# Altium project SVEC.PrjPcb (part 3 of 11)

## Sheet SFPGA.SchDoc: System FPGA
size 420 x 297 mm; CheckedBy: T.Janicki; CompanyName: Creotech Instruments SA; DrawnBy: G.Kasprowicz; Organization: CERN; Address1: European Organization for Nuclear Research; Address2: CH-1211 Geneve 23 - Switzerland; DocumentNumber: 10; Revision: -; SheetNumber: 15; SheetTotal: 21; EDA_Number: EDA-xxxx; Projet: Simple VME FMC Carrier; CreateDate: 20/11/2012; CheckedDate: 30/04/2012; DivGrp: BE-CO; Designer: G.Kasprowicz; DocumentName: SFPGA.SchDoc; ModifiedDate: -; Rule: PcbType=ProtelPcb
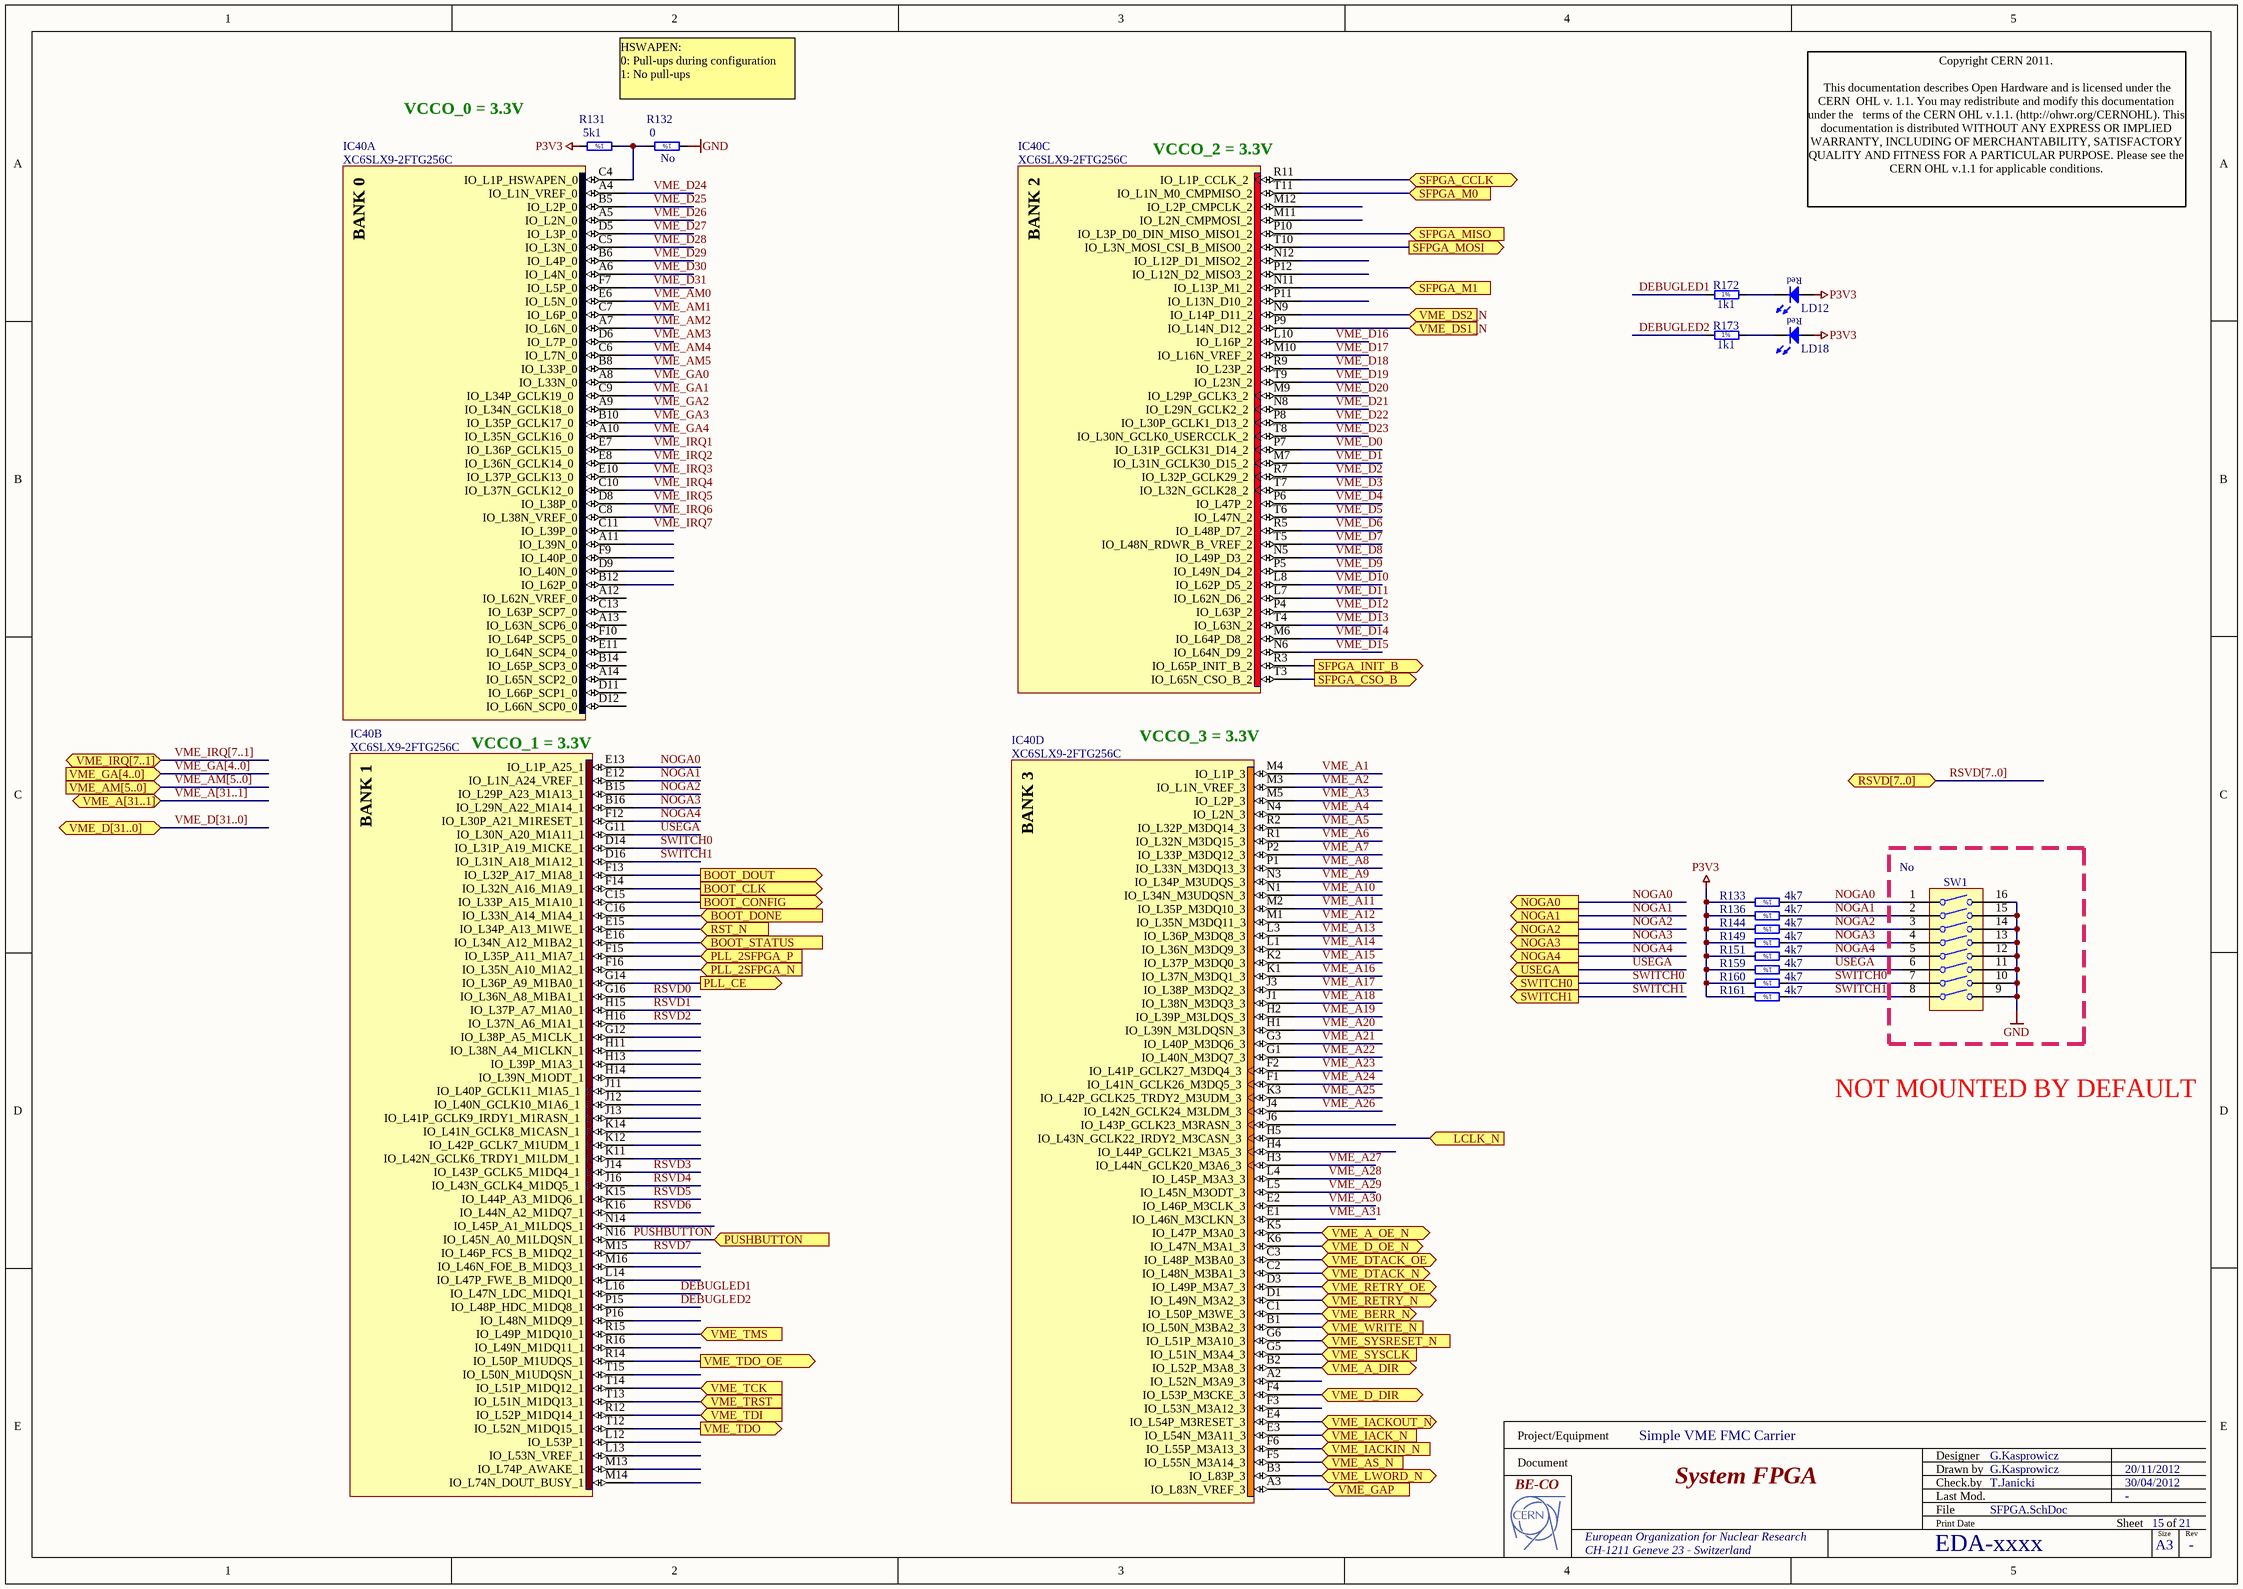
[diagram p2: SFPGA.SchDoc]

### Parts
IC40  XC6SLX9-2FTG256C  [BGA256C100P16X16_1700X1700X155]  (parts A,B,C,D of 7)
LD12  Red  [LEDC1608X80N_RED]  (value not drawn)
LD18  Red  [LEDC1608X80N_RED]  (value not drawn)
R131  5k1  [RESC1608X55N]
R132  0  Mounted: No  [RESC1608X55N]
R133  4k7  [RESC1608X55N]
R136  4k7  [RESC1608X55N]
R144  4k7  [RESC1608X55N]
R149  4k7  [RESC1608X55N]
R151  4k7  [RESC1608X55N]
R159  4k7  [RESC1608X55N]
R160  4k7  [RESC1608X55N]
R161  4k7  [RESC1608X55N]
R172  1k1  [RESC1608X55N]
R173  1k1  [RESC1608X55N]
SW1  Mounted: No  [SW_TYCO_1-1571983-0]  (hidden comment: Switch)

### Ports
BOOT_CLK (out), BOOT_CONFIG (out), BOOT_DONE (in), BOOT_DOUT (out), BOOT_STATUS (in), LCLK_N (in), NOGA0 (out), NOGA1 (out), NOGA2 (out), NOGA3 (out), NOGA4 (out), PLL_2SFPGA_N (in), PLL_2SFPGA_P (in), PLL_CE (out), PUSHBUTTON (in), RST_N (in), RSVD[7..0] (bidir), SFPGA_CCLK (bidir), SFPGA_CSO_B (out), SFPGA_INIT_B (out), SFPGA_M0 (in), SFPGA_M1 (in), SFPGA_MISO (in), SFPGA_MOSI (out), SWITCH0 (out), SWITCH1 (out), USEGA (out), VME_A[31..1] (bidir), VME_A_DIR (bidir), VME_A_OE_N (bidir), VME_AM[5..0] (in), VME_AS_N (in), VME_BERR_N (bidir), VME_D[31..0] (bidir), VME_D_DIR (bidir), VME_D_OE_N (bidir), VME_DS1_N (in), VME_DS2_N (in), VME_DTACK_N (bidir), VME_DTACK_OE (bidir), VME_GA[4..0] (in), VME_GAP (in), VME_IACK_N (in), VME_IACKIN_N (in), VME_IACKOUT_N (bidir), VME_IRQ[7..1] (bidir), VME_LWORD_N (bidir), VME_RETRY_N (bidir), VME_RETRY_OE (bidir), VME_SYSCLK (in), VME_SYSRESET_N (in), VME_TCK (in), VME_TDI (in), VME_TDO (out), VME_TDO_OE (out), VME_TMS (in), VME_TRST (in), VME_WRITE_N (in)

### Nets
GND: R132.1 SW1.9 SW1.10 SW1.11 SW1.12 SW1.13 SW1.14 SW1.15 SW1.16
P3V3: LD12.2(A) LD18.2(A) R131.2 R133.2 R136.2 R144.2 R149.2 R151.2 R159.2 R160.2 R161.2
BOOT_CLK: IC40.F14(IO_L32N_A16_M1A9_1) ; port BOOT_CLK
BOOT_CONFIG: IC40.C15(IO_L33P_A15_M1A10_1) ; port BOOT_CONFIG
BOOT_DONE: IC40.C16(IO_L33N_A14_M1A4_1) ; port BOOT_DONE
BOOT_DOUT: IC40.F13(IO_L32P_A17_M1A8_1) ; port BOOT_DOUT
BOOT_STATUS: IC40.E16(IO_L34N_A12_M1BA2_1) ; port BOOT_STATUS
DEBUGLED1: IC40.L16(IO_L47N_LDC_M1DQ1_1) R172.1
DEBUGLED2: IC40.P15(IO_L48P_HDC_M1DQ8_1) R173.1
LCLK_N: IC40.H5(IO_L43N_GCLK22_IRDY2_M3CASN_3) ; port LCLK_N
NOGA0: IC40.E13(IO_L1P_A25_1) R133.1 SW1.1 ; port NOGA0
NOGA1: IC40.E12(IO_L1N_A24_VREF_1) R136.1 SW1.2 ; port NOGA1
NOGA2: IC40.B15(IO_L29P_A23_M1A13_1) R144.1 SW1.3 ; port NOGA2
NOGA3: IC40.B16(IO_L29N_A22_M1A14_1) R149.1 SW1.4 ; port NOGA3
NOGA4: IC40.F12(IO_L30P_A21_M1RESET_1) R151.1 SW1.5 ; port NOGA4
PLL_2SFPGA_N: IC40.F16(IO_L35N_A10_M1A2_1) ; port PLL_2SFPGA_N
PLL_2SFPGA_P: IC40.F15(IO_L35P_A11_M1A7_1) ; port PLL_2SFPGA_P
PLL_CE: IC40.G14(IO_L36P_A9_M1BA0_1) ; port PLL_CE
PUSHBUTTON: IC40.N16(IO_L45N_A0_M1LDQSN_1) ; port PUSHBUTTON
RST_N: IC40.E15(IO_L34P_A13_M1WE_1) ; port RST_N
RSVD0: IC40.G16(IO_L36N_A8_M1BA1_1)
RSVD1: IC40.H15(IO_L37P_A7_M1A0_1)
RSVD2: IC40.H16(IO_L37N_A6_M1A1_1)
RSVD3: IC40.J14(IO_L43P_GCLK5_M1DQ4_1)
RSVD4: IC40.J16(IO_L43N_GCLK4_M1DQ5_1)
RSVD5: IC40.K15(IO_L44P_A3_M1DQ6_1)
RSVD6: IC40.K16(IO_L44N_A2_M1DQ7_1)
RSVD7: IC40.M15(IO_L46P_FCS_B_M1DQ2_1)
SFPGA_CCLK: IC40.R11(IO_L1P_CCLK_2) ; port SFPGA_CCLK
SFPGA_CSO_B: IC40.T3(IO_L65N_CSO_B_2) ; port SFPGA_CSO_B
SFPGA_INIT_B: IC40.R3(IO_L65P_INIT_B_2) ; port SFPGA_INIT_B
SFPGA_M0: IC40.T11(IO_L1N_M0_CMPMISO_2) ; port SFPGA_M0
SFPGA_M1: IC40.N11(IO_L13P_M1_2) ; port SFPGA_M1
SFPGA_MISO: IC40.P10(IO_L3P_D0_DIN_MISO_MISO1_2) ; port SFPGA_MISO
SFPGA_MOSI: IC40.T10(IO_L3N_MOSI_CSI_B_MISO0_2) ; port SFPGA_MOSI
SWITCH0: IC40.D14(IO_L31P_A19_M1CKE_1) R160.1 SW1.7 ; port SWITCH0
SWITCH1: IC40.D16(IO_L31N_A18_M1A12_1) R161.1 SW1.8 ; port SWITCH1
USEGA: IC40.G11(IO_L30N_A20_M1A11_1) R159.1 SW1.6 ; port USEGA
VME_A1: IC40.M4(IO_L1P_3)
VME_A2: IC40.M3(IO_L1N_VREF_3)
VME_A3: IC40.M5(IO_L2P_3)
VME_A4: IC40.N4(IO_L2N_3)
VME_A5: IC40.R2(IO_L32P_M3DQ14_3)
VME_A6: IC40.R1(IO_L32N_M3DQ15_3)
VME_A7: IC40.P2(IO_L33P_M3DQ12_3)
VME_A8: IC40.P1(IO_L33N_M3DQ13_3)
VME_A9: IC40.N3(IO_L34P_M3UDQS_3)
VME_A10: IC40.N1(IO_L34N_M3UDQSN_3)
VME_A11: IC40.M2(IO_L35P_M3DQ10_3)
VME_A12: IC40.M1(IO_L35N_M3DQ11_3)
VME_A13: IC40.L3(IO_L36P_M3DQ8_3)
VME_A14: IC40.L1(IO_L36N_M3DQ9_3)
VME_A15: IC40.K2(IO_L37P_M3DQ0_3)
VME_A16: IC40.K1(IO_L37N_M3DQ1_3)
VME_A17: IC40.J3(IO_L38P_M3DQ2_3)
VME_A18: IC40.J1(IO_L38N_M3DQ3_3)
VME_A19: IC40.H2(IO_L39P_M3LDQS_3)
VME_A20: IC40.H1(IO_L39N_M3LDQSN_3)
VME_A21: IC40.G3(IO_L40P_M3DQ6_3)
VME_A22: IC40.G1(IO_L40N_M3DQ7_3)
VME_A23: IC40.F2(IO_L41P_GCLK27_M3DQ4_3)
VME_A24: IC40.F1(IO_L41N_GCLK26_M3DQ5_3)
VME_A25: IC40.K3(IO_L42P_GCLK25_TRDY2_M3UDM_3)
VME_A26: IC40.J4(IO_L42N_GCLK24_M3LDM_3)
VME_A27: IC40.H3(IO_L44N_GCLK20_M3A6_3)
VME_A28: IC40.L4(IO_L45P_M3A3_3)
VME_A29: IC40.L5(IO_L45N_M3ODT_3)
VME_A30: IC40.E2(IO_L46P_M3CLK_3)
VME_A31: IC40.E1(IO_L46N_M3CLKN_3)
VME_A_DIR: IC40.B2(IO_L52P_M3A8_3) ; port VME_A_DIR
VME_A_OE_N: IC40.K5(IO_L47P_M3A0_3) ; port VME_A_OE_N
VME_AM0: IC40.E6(IO_L5N_0)
VME_AM1: IC40.C7(IO_L6P_0)
VME_AM2: IC40.A7(IO_L6N_0)
VME_AM3: IC40.D6(IO_L7P_0)
VME_AM4: IC40.C6(IO_L7N_0)
VME_AM5: IC40.B8(IO_L33P_0)
VME_AS_N: IC40.F5(IO_L55N_M3A14_3) ; port VME_AS_N
VME_BERR_N: IC40.C1(IO_L50P_M3WE_3) ; port VME_BERR_N
VME_D0: IC40.P7(IO_L31P_GCLK31_D14_2)
VME_D1: IC40.M7(IO_L31N_GCLK30_D15_2)
VME_D2: IC40.R7(IO_L32P_GCLK29_2)
VME_D3: IC40.T7(IO_L32N_GCLK28_2)
VME_D4: IC40.P6(IO_L47P_2)
VME_D5: IC40.T6(IO_L47N_2)
VME_D6: IC40.R5(IO_L48P_D7_2)
VME_D7: IC40.T5(IO_L48N_RDWR_B_VREF_2)
VME_D8: IC40.N5(IO_L49P_D3_2)
VME_D9: IC40.P5(IO_L49N_D4_2)
VME_D10: IC40.L8(IO_L62P_D5_2)
VME_D11: IC40.L7(IO_L62N_D6_2)
VME_D12: IC40.P4(IO_L63P_2)
VME_D13: IC40.T4(IO_L63N_2)
VME_D14: IC40.M6(IO_L64P_D8_2)
VME_D15: IC40.N6(IO_L64N_D9_2)
VME_D16: IC40.L10(IO_L16P_2)
VME_D17: IC40.M10(IO_L16N_VREF_2)
VME_D18: IC40.R9(IO_L23P_2)
VME_D19: IC40.T9(IO_L23N_2)
VME_D20: IC40.M9(IO_L29P_GCLK3_2)
VME_D21: IC40.N8(IO_L29N_GCLK2_2)
VME_D22: IC40.P8(IO_L30P_GCLK1_D13_2)
VME_D23: IC40.T8(IO_L30N_GCLK0_USERCCLK_2)
VME_D24: IC40.A4(IO_L1N_VREF_0)
VME_D25: IC40.B5(IO_L2P_0)
VME_D26: IC40.A5(IO_L2N_0)
VME_D27: IC40.D5(IO_L3P_0)
VME_D28: IC40.C5(IO_L3N_0)
VME_D29: IC40.B6(IO_L4P_0)
VME_D30: IC40.A6(IO_L4N_0)
VME_D31: IC40.F7(IO_L5P_0)
VME_D_DIR: IC40.F4(IO_L53P_M3CKE_3) ; port VME_D_DIR
VME_D_OE_N: IC40.K6(IO_L47N_M3A1_3) ; port VME_D_OE_N
VME_DS1_N: IC40.P9(IO_L14N_D12_2) ; port VME_DS1_N
VME_DS2_N: IC40.N9(IO_L14P_D11_2) ; port VME_DS2_N
VME_DTACK_N: IC40.C2(IO_L48N_M3BA1_3) ; port VME_DTACK_N
VME_DTACK_OE: IC40.C3(IO_L48P_M3BA0_3) ; port VME_DTACK_OE
VME_GA0: IC40.A8(IO_L33N_0)
VME_GA1: IC40.C9(IO_L34P_GCLK19_0)
VME_GA2: IC40.A9(IO_L34N_GCLK18_0)
VME_GA3: IC40.B10(IO_L35P_GCLK17_0)
VME_GA4: IC40.A10(IO_L35N_GCLK16_0)
VME_GAP: IC40.A3(IO_L83N_VREF_3) ; port VME_GAP
VME_IACK_N: IC40.E3(IO_L54N_M3A11_3) ; port VME_IACK_N
VME_IACKIN_N: IC40.F6(IO_L55P_M3A13_3) ; port VME_IACKIN_N
VME_IACKOUT_N: IC40.E4(IO_L54P_M3RESET_3) ; port VME_IACKOUT_N
VME_IRQ1: IC40.E7(IO_L36P_GCLK15_0)
VME_IRQ2: IC40.E8(IO_L36N_GCLK14_0)
VME_IRQ3: IC40.E10(IO_L37P_GCLK13_0)
VME_IRQ4: IC40.C10(IO_L37N_GCLK12_0)
VME_IRQ5: IC40.D8(IO_L38P_0)
VME_IRQ6: IC40.C8(IO_L38N_VREF_0)
VME_IRQ7: IC40.C11(IO_L39P_0)
VME_LWORD_N: IC40.B3(IO_L83P_3) ; port VME_LWORD_N
VME_RETRY_N: IC40.D1(IO_L49N_M3A2_3) ; port VME_RETRY_N
VME_RETRY_OE: IC40.D3(IO_L49P_M3A7_3) ; port VME_RETRY_OE
VME_SYSCLK: IC40.G5(IO_L51N_M3A4_3) ; port VME_SYSCLK
VME_SYSRESET_N: IC40.G6(IO_L51P_M3A10_3) ; port VME_SYSRESET_N
VME_TCK: IC40.T14(IO_L51P_M1DQ12_1) ; port VME_TCK
VME_TDI: IC40.R12(IO_L52P_M1DQ14_1) ; port VME_TDI
VME_TDO: IC40.T12(IO_L52N_M1DQ15_1) ; port VME_TDO
VME_TDO_OE: IC40.R14(IO_L50P_M1UDQS_1) ; port VME_TDO_OE
VME_TMS: IC40.R15(IO_L49P_M1DQ10_1) ; port VME_TMS
VME_TRST: IC40.T13(IO_L51N_M1DQ13_1) ; port VME_TRST
VME_WRITE_N: IC40.B1(IO_L50N_M3BA2_3) ; port VME_WRITE_N
NetIC40_C4: IC40.C4(IO_L1P_HSWAPEN_0) R131.1 R132.2
NetLD12_1: LD12.1(C) R172.2
NetLD18_1: LD18.1(C) R173.2

Not connected (* = marked no-connect by the designer): IC40 A2(IO_L52N_M3A9_3) A11(IO_L39N_0) A12(IO_L62N_VREF_0) A13(IO_L63N_SCP6_0) A14(IO_L65N_SCP2_0) B12(IO_L62P_0) B14(IO_L65P_SCP3_0) C13(IO_L63P_SCP7_0) D9(IO_L40N_0) D11(IO_L66P_SCP1_0) D12(IO_L66N_SCP0_0) E11(IO_L64N_SCP4_0) F3(IO_L53N_M3A12_3) F9(IO_L40P_0) F10(IO_L64P_SCP5_0) G12(IO_L38P_A5_M1CLK_1) H4(IO_L44P_GCLK21_M3A5_3) H11(IO_L38N_A4_M1CLKN_1) H13(IO_L39P_M1A3_1) H14(IO_L39N_M1ODT_1) J6(IO_L43P_GCLK23_M3RASN_3) J11(IO_L40P_GCLK11_M1A5_1) J12(IO_L40N_GCLK10_M1A6_1) J13(IO_L41P_GCLK9_IRDY1_M1RASN_1) K11(IO_L42N_GCLK6_TRDY1_M1LDM_1) K12(IO_L42P_GCLK7_M1UDM_1) K14(IO_L41N_GCLK8_M1CASN_1) L12(IO_L53P_1) L13(IO_L53N_VREF_1) L14(IO_L47P_FWE_B_M1DQ0_1) M11(IO_L2N_CMPMOSI_2) M12(IO_L2P_CMPCLK_2) M13(IO_L74P_AWAKE_1) M14(IO_L74N_DOUT_BUSY_1) M16(IO_L46N_FOE_B_M1DQ3_1) N12(IO_L12P_D1_MISO2_2) N14(IO_L45P_A1_M1LDQS_1) P11(IO_L13N_D10_2) P12(IO_L12N_D2_MISO3_2) P16(IO_L48N_M1DQ9_1) R16(IO_L49N_M1DQ11_1) T15(IO_L50N_M1UDQSN_1)

### Buses and harness runs
bus RSVD[7..0] = port RSVD[7..0]
bus VME_A[31..1] = port VME_A[31..1]
bus VME_AM[5..0] = port VME_AM[5..0]
bus VME_D[31..0] = port VME_D[31..0]
bus VME_GA[4..0] = port VME_GA[4..0]
bus VME_IRQ[7..1] = port VME_IRQ[7..1]

### Notes on the sheet
- VCCO_0 = 3.3V
- HSWAPEN:
  0: Pull-ups during configuration
  1: No pull-ups
- (near IC40) VCCO_2 = 3.3V
- Copyright CERN 2011.
  This documentation describes Open Hardware and is licensed under the CERN  OHL v. 1.1. You may redistribute and modify this documentation under the   terms of the CERN OHL v.1.1. (http://ohwr.org/CERNOHL). This  documentation is distributed WITHOUT ANY EXPRESS OR IMPLIED  WARRANTY, INCLUDING OF MERCHANTABILITY, SATISFACTORY  QUALITY AND FITNESS FOR A PARTICULAR PURPOSE. Please see the  CERN OHL v.1.1 for applicable conditions.
- (near IC40) VCCO_1 = 3.3V
- (near IC40) VCCO_3 = 3.3V
- NOT MOUNTED BY DEFAULT
- Project/Equipment
- Document
- Designer
- Drawn by
- Check.by
- File
- Last Mod.
- Print Date
- Sheet
- Size
- A3
- of
- Rev
- (in symbol R0603_0R_JUMPER) 1%
- (in symbol R0603_1K1_1%_0.1W_100PPM) 1%
- (in symbol R0603_4K7_1%_0.1W_100PPM) 1%
- (in symbol R0603_5K1_1%_0.1W_100PPM) 1%
- (in symbol XC6SLX9-2FTG256C, part A) BANK 0
- (in symbol XC6SLX9-2FTG256C, part B) BANK 1
- (in symbol XC6SLX9-2FTG256C, part C) BANK 2
- (in symbol XC6SLX9-2FTG256C, part D) BANK 3

### Library data of the parts
IC40 = XC6SLX9-2FTG256C: Spartan-6 LX 1.2V FPGA, 186 User I/Os, 256-Ball Fine-Pitch Thin BGA (1.0mm Pitch), Speed Grade 2, Commercial Grade, Pb-Free; Manufacturer: XILINX; Table: Logic; Part Number: XC6SLX9-2FTG256C; Component Kind: Standard; Component Type: Standard; Device: XC6SLX9-2FTG256C; PackageDescription: BGA 1mm, Pitch, Square 256 Pin, 16 Columns x 16 Rows, Body 17mm X 17mm X 1.55mm H; Part Description: Spartan-6 LX 1.2V FPGA, 186 User I/Os, 256-Ball Fine-Pitch Thin BGA (1.0mm Pitch), Speed Grade 2, Commercial Grade, Pb-Free; Manufacturer Part Number: XC6SLX9-2FTG256C; Pin Count: 256; Case: BGA256; Mounted: Yes; Socket: No; SMD: Yes; ComponentHeight: 1.55mm; HelpURL: \\cern.ch\dfs\Applications\Altium\Datasheets\XC6SLX9-2FTG256C.pdf; ComponentLink1URL: \\cern.ch\dfs\Applications\Altium\Datasheets\XC6SLX9-2FTG256C_Package-Pinout.pdf; ComponentLink1Description: Package/Pinouts; Author: CERN DEM JLC; CreateDate: 2011-11-01; LatestRevisionDate: 2011-11-01
LD12 LD18 = LED_ROHM_SML-311UTT86K: LED Red 1C 2A; Part Description: Low current chip LED SML-311 Serie; Manufacturer: ROHM; Table: LEDs & Displays; Part Number: LED_ROHM_SML-311UTT86K; Component Kind: Standard; Component Type: Standard; Color: Red; PackageDescription: Chip RED LED, 2-Leads, Body 1.6x0.8mm, IPC Medium Density; Manufacturer Part Number: SML-311UTT86K; Pin Count: 2; Mounted: Yes; Socket: No; SMD: Yes; ComponentHeight: 0.8mm; HelpURL: \\cern.ch\dfs\Applications\Altium\Datasheets\LED_ROHM_SML-311UTT86K.pdf; Author: CERN DEM JLC; CreateDate: 3/16/2010; LatestRevisionDate: 3/17/2010
R131 = R0603_5K1_1%_0.1W_100PPM: Resistor - 1%; Part Description: General Purpose Thick Film Chip Resistor; Manufacturer: GENERIC; Manufacturer1 Part Number: NRC06F5101TRF; Power: 0.1W; TC: ±100ppm/°C; Table: Resistors SMD; Part Number: R0603_5K1_1%_0.1W_100PPM; Component Kind: Standard; Component Type: Standard; Pin Count: 2; Value: 5k1; Status: Preferred; Tolerance: ±1%; Manufacturer Part Number: R0603_5K1_1%_0.1W_100PPM; Case: 0603; Mounted: Yes; Socket: No; SMD: Yes; Manufacturer1 Example: NIC COMPONENT; Manufacturer1 ComponentHeight: 0.55mm; HelpURL: \\cern.ch\dfs\Applications\Altium\Datasheets\R0603_NIC_NRC.pdf; Author: CERN DEM JLC; CreateDate: 03/12/2007; LatestRevisionDate: 13/03/2008
R132 = R0603_0R_JUMPER: Resistor - 1%; Part Description: 1A (0.05R Max DC Resistance) Zero Ohm Jumper; Manufacturer: GENERIC; Manufacturer1 Part Number: NRC06Z0; Table: Resistors SMD; Part Number: R0603_0R_JUMPER; Component Kind: Standard; Component Type: Standard; Pin Count: 2; Value: 0; Status: Preferred; Manufacturer Part Number: R0603_0R_JUMPER; Case: 0603; Socket: No; SMD: Yes; Manufacturer1 Example: NIC COMPONENT; Manufacturer1 ComponentHeight: 0.55mm; HelpURL: \\cern.ch\dfs\Applications\Altium\Datasheets\R0603_NIC_NRC.pdf; Author: CERN DEM JLC; CreateDate: 12/3/2007; LatestRevisionDate: 3/13/2008
R133 R136 R144 R149 R151 R159-R161 = R0603_4K7_1%_0.1W_100PPM: Resistor - 1%; Part Description: General Purpose Thick Film Chip Resistor; Manufacturer: GENERIC; Manufacturer1 Part Number: NRC06F4701TRF; Power: 0.1W; TC: ±100ppm/°C; Table: Resistors SMD; Part Number: R0603_4K7_1%_0.1W_100PPM; Component Kind: Standard; Component Type: Standard; Pin Count: 2; Value: 4k7; Status: Preferred; Tolerance: ±1%; Manufacturer Part Number: R0603_4K7_1%_0.1W_100PPM; Case: 0603; Mounted: Yes; Socket: No; SMD: Yes; Manufacturer1 Example: NIC COMPONENT; Manufacturer1 ComponentHeight: 0.55mm; HelpURL: \\cern.ch\dfs\Applications\Altium\Datasheets\R0603_NIC_NRC.pdf; Author: CERN DEM JLC; CreateDate: 03/12/2007; LatestRevisionDate: 13/03/2008
R172 R173 = R0603_1K1_1%_0.1W_100PPM: Resistor - 1%; Part Description: General Purpose Thick Film Chip Resistor; Manufacturer: GENERIC; Manufacturer1 Part Number: NRC06F1101TRF; Power: 0.1W; TC: ±100ppm/°C; Table: Resistors SMD; Part Number: R0603_1K1_1%_0.1W_100PPM; Component Kind: Standard; Component Type: Standard; Pin Count: 2; Value: 1k1; Status: Preferred; Tolerance: ±1%; Manufacturer Part Number: R0603_1K1_1%_0.1W_100PPM; Case: 0603; Mounted: Yes; Socket: No; SMD: Yes; Manufacturer1 Example: NIC COMPONENT; Manufacturer1 ComponentHeight: 0.55mm; HelpURL: \\cern.ch\dfs\Applications\Altium\Datasheets\R0603_NIC_NRC.pdf; Author: CERN DEM JLC; CreateDate: 2007-12-03; LatestRevisionDate: 2008-03-13
SW1 = SW_TYCO_1-1571983-0: 8 Ways SPST DIP Switch; Part Description: 8 Way SPST SMD DIP Switch, Latched, Contact Rating 0.025A 24VDC; Manufacturer: TYCO; Manufacturer Part Number: 1-1571983-0 or GDH08S04; Table: Switches; Part Number: SW_TYCO_1-1571983-0; Component Kind: Standard; Component Type: Standard; Pin Count: 16; PackageDescription: Pitch 1.27mm,  Body 11.28x6.2mm, 8 Ways SPST Surface-Mount DIP Switch,TYCO GDH Serie; Family: Switch; Socket: No; SMD: Yes; Status: None; ComponentHeight: 2.31mm; HelpURL: \\cern.ch\dfs\Applications\Altium\Datasheets\SW_TYCO_1-1571983-0.pdf; Author: CERN DEM JLC; CreateDate: 08/01/2009; LatestRevisionDate: 08/01/2009

## Sheet Clk_generation.SchDoc: Clock Generators
size 420 x 297 mm; CheckedBy: T.Janicki; CompanyName: Creotech Instruments SA; DrawnBy: G.Kasprowicz; Organization: CERN; Address1: European Organization for Nuclear Research; Address2: CH-1211 Geneve 23 - Switzerland; DocumentNumber: 10; Revision: -; SheetNumber: 9; SheetTotal: 21; EDA_Number: EDA-xxxx; Projet: Simple VME FMC Carrier; CreateDate: 20/11/2012; CheckedDate: 30/04/2012; DivGrp: BE-CO; Designer: G.Kasprowicz; DocumentName: ClkGeneration.SchDoc; ModifiedDate: -; Rule: PcbType=ProtelPcb
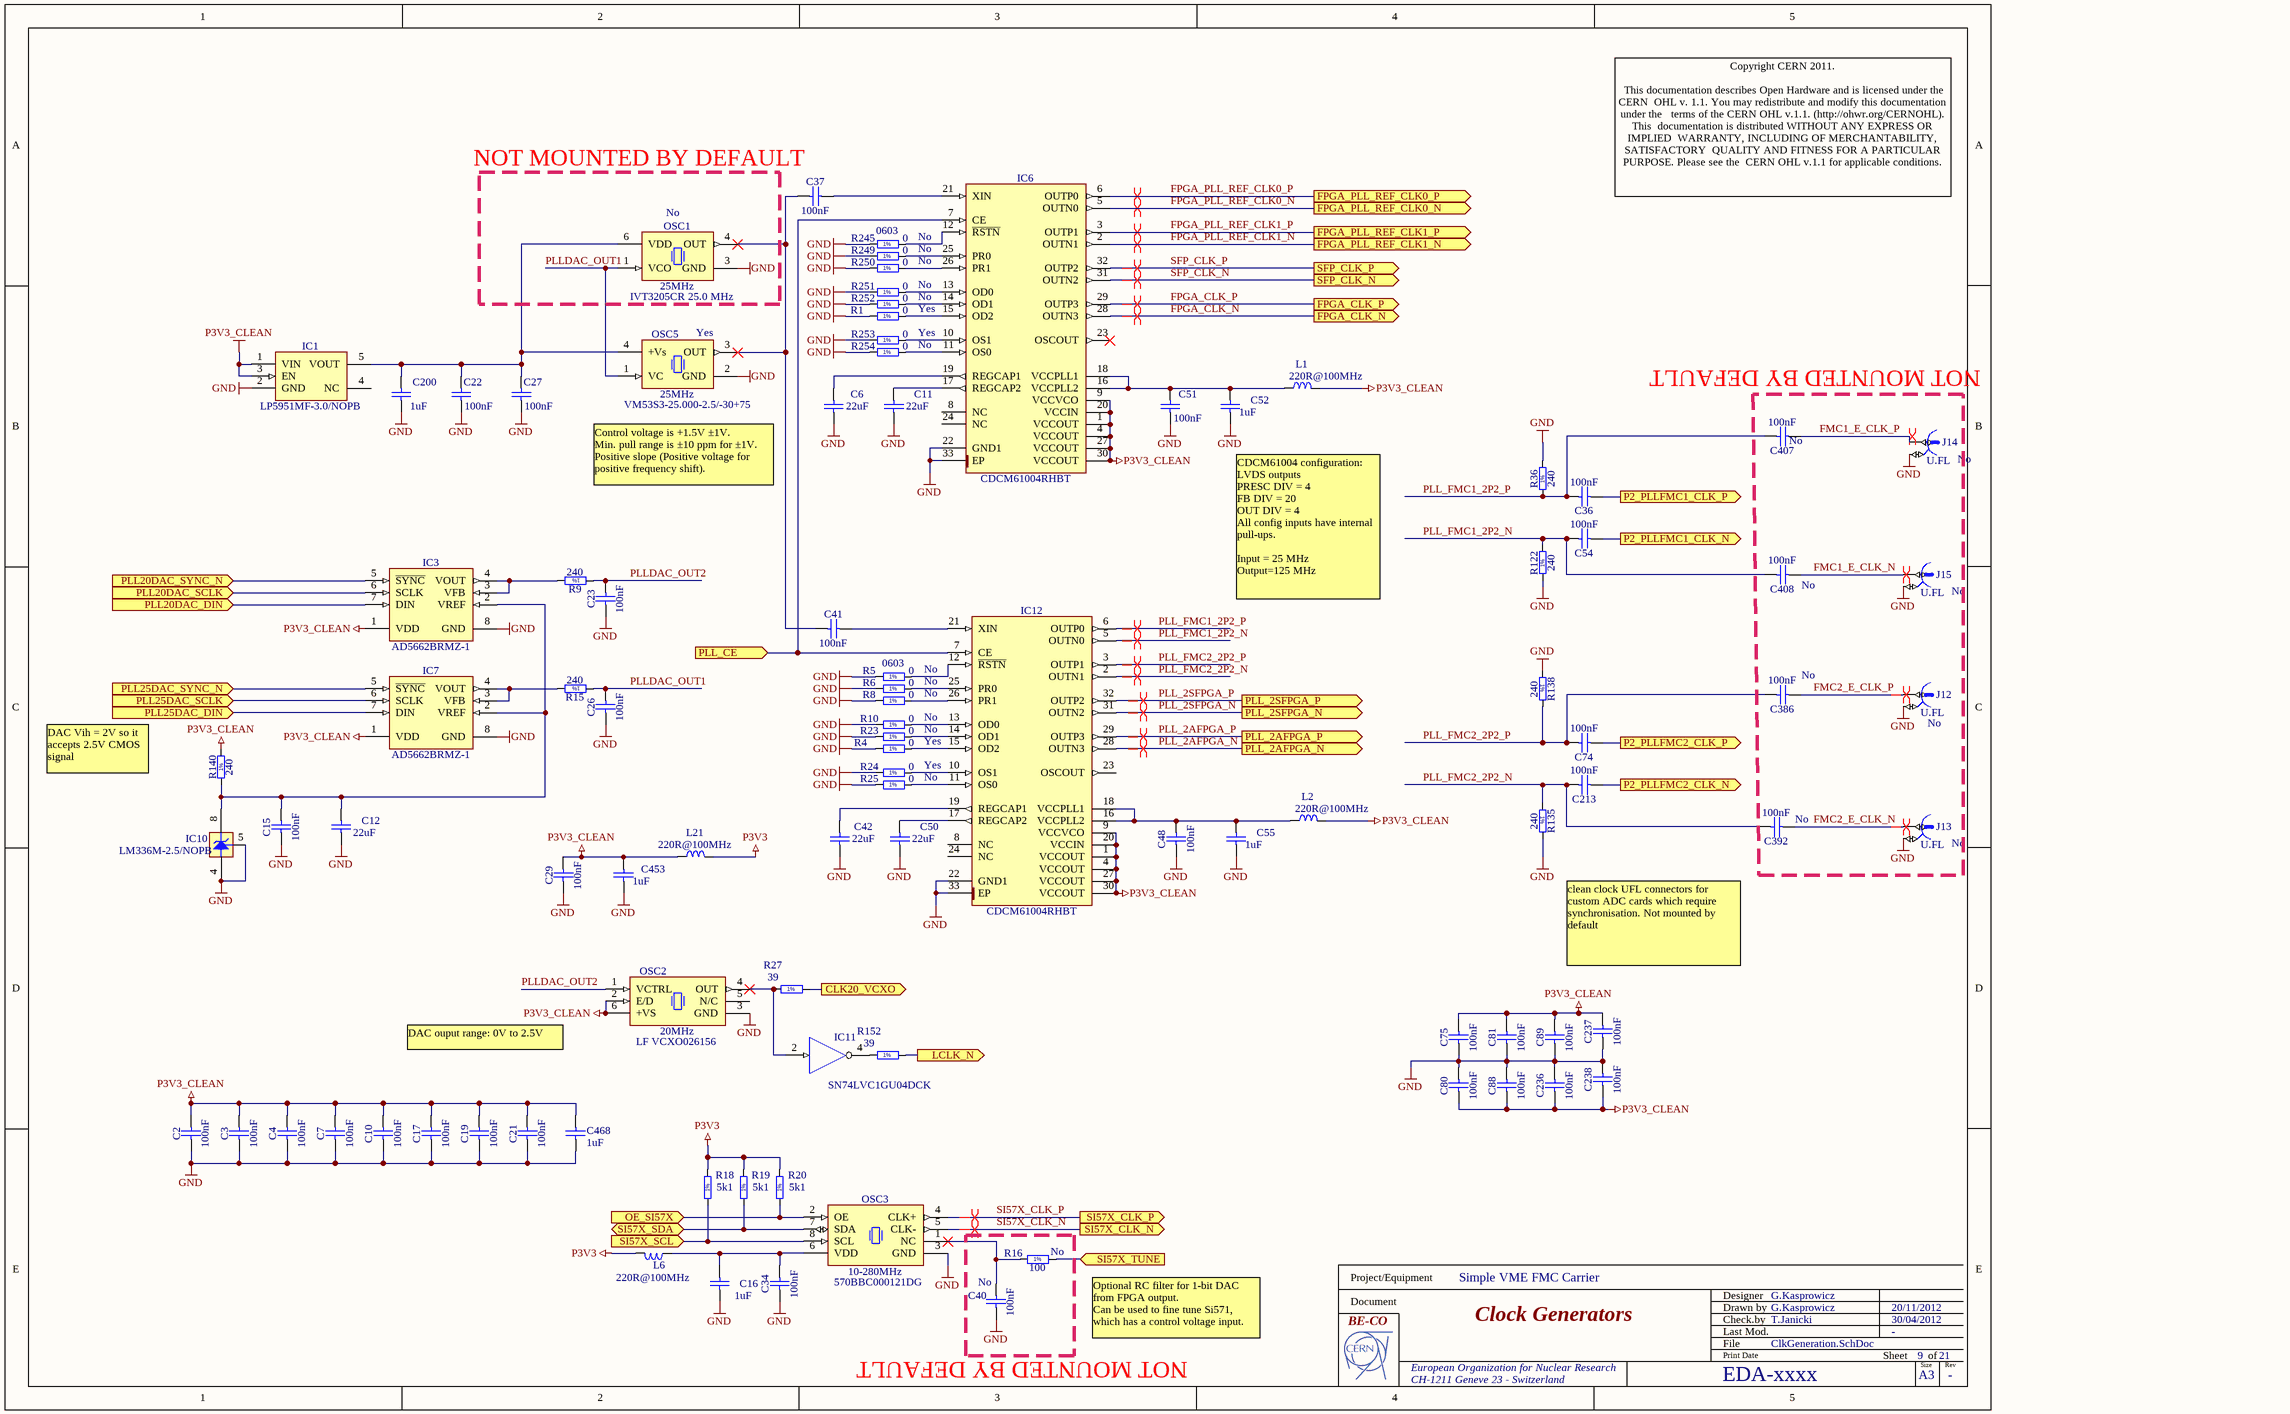
[diagram p3: Clk_generation.SchDoc]

### Parts
C2  100nF  [CAPC1005X55N]
C3  100nF  [CAPC1005X55N]
C4  100nF  [CAPC1005X55N]
C6  22uF  [CAPC3216X180N]
C7  100nF  [CAPC1005X55N]
C10  100nF  [CAPC1005X55N]
C11  22uF  [CAPC3216X180N]
C12  22uF  [CAPC3216X180N]
C15  100nF  [CAPC1005X55N]
C16  1uF  [CAPC1608X87N]
C17  100nF  [CAPC1005X55N]
C19  100nF  [CAPC1005X55N]
C21  100nF  [CAPC1005X55N]
C22  100nF  [CAPC1005X55N]
C23  100nF  [CAPC1005X55N]
C26  100nF  [CAPC1005X55N]
C27  100nF  [CAPC1005X55N]
C29  100nF  [CAPC1005X55N]
C34  100nF  [CAPC1005X55N]
C36  100nF  [CAPC1005X55N]
C37  100nF  [CAPC1005X55N]
C40  100nF  Mounted: No  [CAPC1005X55N]
C41  100nF  [CAPC1005X55N]
C42  22uF  [CAPC3216X180N]
C48  100nF  [CAPC1005X55N]
C50  22uF  [CAPC3216X180N]
C51  100nF  [CAPC1005X55N]
C52  1uF  [CAPC1608X87N]
C54  100nF  [CAPC1005X55N]
C55  1uF  [CAPC1608X87N]
C74  100nF  [CAPC1005X55N]
C75  100nF  [CAPC1005X55N]
C80  100nF  [CAPC1005X55N]
C81  100nF  [CAPC1005X55N]
C88  100nF  [CAPC1005X55N]
C89  100nF  [CAPC1005X55N]
C200  1uF  [CAPC1608X87N]
C213  100nF  [CAPC1005X55N]
C236  100nF  [CAPC1005X55N]
C237  100nF  [CAPC1005X55N]
C238  100nF  [CAPC1005X55N]
C386  100nF  Mounted: No  [CAPC1005X55N]
C392  100nF  Mounted: No  [CAPC1005X55N]
C407  100nF  Mounted: No  [CAPC1005X55N]
C408  100nF  Mounted: No  [CAPC1005X55N]
C453  1uF  [CAPC1608X87N]
C468  1uF  [CAPC1608X87N]
IC1  LP5951MF-3.0/NOPB  [SOT95P284X122-5N]
IC3  AD5662BRMZ-1  [SOP65P490X110-8N]
IC6  CDCM61004RHBT  [QFN50P500X500X100-33N-S355]
IC7  AD5662BRMZ-1  [SOP65P490X110-8N]
IC10  LM336M-2.5/NOPB  [SOIC127P600X175-8N]
IC11  SN74LVC1GU04DCK  [SOT65P210X110-5N]
IC12  CDCM61004RHBT  [QFN50P500X500X100-33N-S355]
J12  U.FL  Mounted: No  [HIROSE_U.FL-R-SMT-1(10)]
J13  U.FL  Mounted: No  [HIROSE_U.FL-R-SMT-1(10)]
J14  U.FL  Mounted: No  [HIROSE_U.FL-R-SMT-1(10)]
J15  U.FL  Mounted: No  [HIROSE_U.FL-R-SMT-1(10)]
L1  220R@100MHz  [INDC2012X105N]
L2  220R@100MHz  [INDC2012X105N]
L6  220R@100MHz  [INDC2012X105N]
L21  220R@100MHz  [INDC2012X105N]
OSC1  25MHz  Manufacturer Part Number: IVT3205CR 25.0 MHz  Mounted: No  [OSC_RAKON_IVT3200C]
OSC2  20MHz  Manufacturer Part Number: LF VCXO026156  [OSC_IQD_CFPV-45]
OSC3  10-280MHz  Manufacturer Part Number: 570BBC000121DG  [OSC_SILICON-LAB_SI570]
OSC5  25MHz  Manufacturer Part Number: VM53S3-25.000-2.5/-30+75  Mounted: Yes  [OSCCC320X500X160-4N]
R1  0  Mounted: Yes  [RESC1608X55N]
R4  0  Mounted: Yes  [RESC1608X55N]
R5  0  Case: 0603  Mounted: No  [RESC1608X55N]
R6  0  Mounted: No  [RESC1608X55N]
R8  0  Mounted: No  [RESC1608X55N]
R9  240  [RESC1608X55N]
R10  0  Mounted: No  [RESC1608X55N]
R15  240  [RESC1608X55N]
R16  100  Mounted: No  [RESC1608X55N]
R18  5k1  [RESC1608X55N]
R19  5k1  [RESC1608X55N]
R20  5k1  [RESC1608X55N]
R23  0  Mounted: No  [RESC1608X55N]
R24  0  Mounted: Yes  [RESC1608X55N]
R25  0  Mounted: No  [RESC1608X55N]
R27  39  [RESC1608X55N]
R36  240  [RESC1608X55N]
R122  240  [RESC1608X55N]
R135  240  [RESC1608X55N]
R138  240  [RESC1608X55N]
R140  240  [RESC1608X55N]
R152  39  [RESC1608X55N]
R245  0  Case: 0603  Mounted: No  [RESC1608X55N]
R249  0  Mounted: No  [RESC1608X55N]
R250  0  Mounted: No  [RESC1608X55N]
R251  0  Mounted: No  [RESC1608X55N]
R252  0  Mounted: No  [RESC1608X55N]
R253  0  Mounted: Yes  [RESC1608X55N]
R254  0  Mounted: No  [RESC1608X55N]

### Ports
CLK20_VCXO (out), FPGA_CLK_N (out), FPGA_CLK_P (out), FPGA_PLL_REF_CLK0_N (out), FPGA_PLL_REF_CLK0_P (out), FPGA_PLL_REF_CLK1_N (out), FPGA_PLL_REF_CLK1_P (out), LCLK_N (out), OE_SI57X (in), P2_PLLFMC1_CLK_N (out), P2_PLLFMC1_CLK_P (out), P2_PLLFMC2_CLK_N (out), P2_PLLFMC2_CLK_P (out), PLL20DAC_DIN (in), PLL20DAC_SCLK (in), PLL20DAC_SYNC_N (in), PLL25DAC_DIN (in), PLL25DAC_SCLK (in), PLL25DAC_SYNC_N (in), PLL_2AFPGA_N (out), PLL_2AFPGA_P (out), PLL_2SFPGA_N (out), PLL_2SFPGA_P (out), PLL_CE (in), SFP_CLK_N (out), SFP_CLK_P (out), SI57X_CLK_N (out), SI57X_CLK_P (out), SI57X_SCL (in), SI57X_SDA (bidir), SI57X_TUNE (in)

### Nets
GND: C2.1 C3.1 C4.1 C6.1 C7.1 C10.1 C11.1 C12.1 C15.1 C16.1 C17.1 C19.1 C21.1 C22.1 C23.1 C26.1 C27.1 C29.1 C34.1 C40.1 C42.1 C48.1 C50.1 C51.1 C52.1 C55.1 C75.1 C80.2 C81.1 C88.2 C89.1 C200.1 C236.2 C237.1 C238.2 C453.1 C468.1 IC1.2(GND) IC3.8(GND) IC6.22(GND1) IC6.33(EP) IC7.8(GND) IC10.4(A) IC10.5(Adj) IC11.3(GND) IC12.22(GND1) IC12.33(EP) J12.2 J13.2 J14.2 J15.2 OSC1.3(GND) OSC2.3(GND) OSC3.3(GND) OSC5.2(GND) R1.1 R4.1 R5.1 R6.1 R8.1 R10.1 R23.1 R24.1 R25.1 R36.2 R122.1 R135.2 R138.1 R245.1 R249.1 R250.1 R251.1 R252.1 R253.1 R254.1
P3V3: IC11.5(VCC) L6.2 L21.2 R18.2 R19.2 R20.2
P3V3_CLEAN: C2.2 C3.2 C4.2 C7.2 C10.2 C17.2 C19.2 C21.2 C29.2 C75.2 C80.1 C81.2 C88.1 C89.2 C236.1 C237.2 C238.1 C453.2 C468.2 IC1.1(VIN) IC1.3(EN) IC3.1(VDD) IC6.1(VCCOUT) IC6.4(VCCOUT) IC6.9(VCCVCO) IC6.20(VCCIN) IC6.27(VCCOUT) IC6.30(VCCOUT) IC7.1(VDD) IC12.1(VCCOUT) IC12.4(VCCOUT) IC12.9(VCCVCO) IC12.20(VCCIN) IC12.27(VCCOUT) IC12.30(VCCOUT) L1.2 L2.2 L21.1 OSC2.2(E/D) OSC2.6(+VS) R140.2
CLK20_VCXO: R27.2 ; port CLK20_VCXO
FMC1_E_CLK_N: C408.1 J15.1
FMC1_E_CLK_P: C407.1 J14.1
FMC2_E_CLK_N: C392.1 J13.1
FMC2_E_CLK_P: C386.1 J12.1
FPGA_CLK_N: IC6.28(OUTN3) ; port FPGA_CLK_N
FPGA_CLK_P: IC6.29(OUTP3) ; port FPGA_CLK_P
FPGA_PLL_REF_CLK0_N: IC6.5(OUTN0) ; port FPGA_PLL_REF_CLK0_N
FPGA_PLL_REF_CLK0_P: IC6.6(OUTP0) ; port FPGA_PLL_REF_CLK0_P
FPGA_PLL_REF_CLK1_N: IC6.2(OUTN1) ; port FPGA_PLL_REF_CLK1_N
FPGA_PLL_REF_CLK1_P: IC6.3(OUTP1) ; port FPGA_PLL_REF_CLK1_P
LCLK_N: R152.2 ; port LCLK_N
OE_SI57X: OSC3.2(OE) R20.1 ; port OE_SI57X
P2_PLLFMC1_CLK_N: C54.1 ; port P2_PLLFMC1_CLK_N
P2_PLLFMC1_CLK_P: C36.1 ; port P2_PLLFMC1_CLK_P
P2_PLLFMC2_CLK_N: C213.1 ; port P2_PLLFMC2_CLK_N
P2_PLLFMC2_CLK_P: C74.1 ; port P2_PLLFMC2_CLK_P
PLL20DAC_DIN: IC3.7(DIN) ; port PLL20DAC_DIN
PLL20DAC_SCLK: IC3.6(SCLK) ; port PLL20DAC_SCLK
PLL20DAC_SYNC_N: IC3.5(~{SYNC}) ; port PLL20DAC_SYNC_N
PLL25DAC_DIN: IC7.7(DIN) ; port PLL25DAC_DIN
PLL25DAC_SCLK: IC7.6(SCLK) ; port PLL25DAC_SCLK
PLL25DAC_SYNC_N: IC7.5(~{SYNC}) ; port PLL25DAC_SYNC_N
PLL_2AFPGA_N: IC12.28(OUTN3) ; port PLL_2AFPGA_N
PLL_2AFPGA_P: IC12.29(OUTP3) ; port PLL_2AFPGA_P
PLL_2SFPGA_N: IC12.31(OUTN2) ; port PLL_2SFPGA_N
PLL_2SFPGA_P: IC12.32(OUTP2) ; port PLL_2SFPGA_P
PLL_CE: IC6.7(CE) IC12.7(CE) ; port PLL_CE
PLL_FMC1_2P2_N: C54.2 C408.2 IC12.5(OUTN0) R122.2
PLL_FMC1_2P2_P: C36.2 C407.2 IC12.6(OUTP0) R36.1
PLL_FMC2_2P2_N: C213.2 C392.2 IC12.2(OUTN1) R135.1
PLL_FMC2_2P2_P: C74.2 C386.2 IC12.3(OUTP1) R138.2
PLLDAC_OUT1: C26.2 OSC1.1(VCO) OSC5.1(VC) R15.1
PLLDAC_OUT2: C23.2 OSC2.1(VCTRL) R9.1
SFP_CLK_N: IC6.31(OUTN2) ; port SFP_CLK_N
SFP_CLK_P: IC6.32(OUTP2) ; port SFP_CLK_P
SI57X_CLK_N: OSC3.5(CLK-) ; port SI57X_CLK_N
SI57X_CLK_P: OSC3.4(CLK+) ; port SI57X_CLK_P
SI57X_SCL: OSC3.8(SCL) R18.1 ; port SI57X_SCL
SI57X_SDA: OSC3.7(SDA) R19.1 ; port SI57X_SDA
SI57X_TUNE: R16.2 ; port SI57X_TUNE
NetC6_2: C6.2 IC6.19(REGCAP1)
NetC11_2: C11.2 IC6.17(REGCAP2)
NetC12_2: C12.2 C15.2 IC3.2(VREF) IC7.2(VREF) IC10.8(C) R140.1
NetC16_2: C16.2 C34.2 L6.1 OSC3.6(VDD)
NetC22_2: C22.2 C27.2 C200.2 IC1.5(VOUT) OSC1.6(VDD) OSC5.4(+Vs)
NetC37_1: C37.1 C41.1 OSC1.4(OUT) OSC5.3(OUT)
NetC37_2: C37.2 IC6.21(XIN)
NetC40_2: C40.2 OSC3.1(NC) R16.1
NetC41_2: C41.2 IC12.21(XIN)
NetC42_2: C42.2 IC12.19(REGCAP1)
NetC48_2: C48.2 C55.2 IC12.16(VCCPLL2) IC12.18(VCCPLL1) L2.1
NetC50_2: C50.2 IC12.17(REGCAP2)
NetC51_2: C51.2 C52.2 IC6.16(VCCPLL2) IC6.18(VCCPLL1) L1.1
NetIC3_3: IC3.3(VFB) IC3.4(VOUT) R9.2
NetIC6_10: IC6.10(OS1) R253.2
NetIC6_11: IC6.11(OS0) R254.2
NetIC6_12: IC6.12(~{RSTN}) R245.2
NetIC6_13: IC6.13(OD0) R251.2
NetIC6_14: IC6.14(OD1) R252.2
NetIC6_15: IC6.15(OD2) R1.2
NetIC6_25: IC6.25(PR0) R249.2
NetIC6_26: IC6.26(PR1) R250.2
NetIC7_3: IC7.3(VFB) IC7.4(VOUT) R15.2
NetIC11_2: IC11.2(IN) OSC2.4(OUT) R27.1
NetIC11_4: IC11.4(OUT) R152.1
NetIC12_10: IC12.10(OS1) R24.2
NetIC12_11: IC12.11(OS0) R25.2
NetIC12_12: IC12.12(~{RSTN}) R5.2
NetIC12_13: IC12.13(OD0) R10.2
NetIC12_14: IC12.14(OD1) R23.2
NetIC12_15: IC12.15(OD2) R4.2
NetIC12_25: IC12.25(PR0) R6.2
NetIC12_26: IC12.26(PR1) R8.2

Not connected (* = marked no-connect by the designer): IC1 4(NC); IC6 8(NC) 23(OSCOUT)* 24(NC); IC12 8(NC) 23(OSCOUT) 24(NC); OSC2 5(N/C)

### Layout directives
differential pair: FMC1_E_CLK_N, FMC1_E_CLK_P, FMC2_E_CLK_N, FMC2_E_CLK_P, FPGA_CLK_N, FPGA_CLK_P, FPGA_PLL_REF_CLK0_N, FPGA_PLL_REF_CLK0_P, FPGA_PLL_REF_CLK1_N, FPGA_PLL_REF_CLK1_P, PLL_2AFPGA_N, PLL_2AFPGA_P, PLL_2SFPGA_N, PLL_2SFPGA_P, PLL_FMC1_2P2_N, PLL_FMC1_2P2_P, PLL_FMC2_2P2_N, PLL_FMC2_2P2_P, SFP_CLK_N, SFP_CLK_P, SI57X_CLK_N, SI57X_CLK_P

### Notes on the sheet
- NOT MOUNTED BY DEFAULT
- Copyright CERN 2011.
  This documentation describes Open Hardware and is licensed under the CERN  OHL v. 1.1. You may redistribute and modify this documentation under the   terms of the CERN OHL v.1.1. (http://ohwr.org/CERNOHL). This  documentation is distributed WITHOUT ANY EXPRESS OR IMPLIED  WARRANTY, INCLUDING OF MERCHANTABILITY, SATISFACTORY  QUALITY AND FITNESS FOR A PARTICULAR PURPOSE. Please see the  CERN OHL v.1.1 for applicable conditions.
- Control voltage is +1.5V ±1V.
  Min. pull range is ±10 ppm for ±1V.
  Positive slope (Positive voltage for positive frequency shift).
- CDCM61004 configuration:
  LVDS outputs
  PRESC DIV = 4
  FB DIV = 20
  OUT DIV = 4
  All config inputs have internal pull-ups.
  Input = 25 MHz
  Output=125 MHz
- DAC Vih = 2V so it accepts 2.5V CMOS signal
- clean clock UFL connectors for custom ADC cards which require synchronisation. Not mounted by default
- DAC ouput range: 0V to 2.5V
- (near R16) Optional RC filter for 1-bit DAC from FPGA output.
  Can be used to fine tune Si571, which has a control voltage input.
- Project/Equipment
- Document
- Designer
- Drawn by
- Check.by
- File
- Last Mod.
- Print Date
- Sheet
- Size
- A3
- of
- Rev
- (in symbol R0603_0R_JUMPER) 1%
- (in symbol R0603_5K1_1%_0.1W_100PPM) 1%
- (in symbol R0603_39R_1%_0.1W_100PPM) 1%
- (in symbol R0603_100R_1%_0.1W_100PPM) 1%
- (in symbol R0603_240R_1%_0.1W_100PPM) 1%

### Library data of the parts
C2-C4 C7 C10 C15 C17 C19 C21-C23 C26 C27 C29 C34 C36 C37 C40 C41 C48 C51 C54 C74 C75 C80 C81 C88 C89 C213 C236-C238 C386 C392 C407 C408 = CC0402_100NF_16V_10%_X7R: Non-polarised capacitor; Part Description: SMD Multilayer Chip Ceramic Capacitor; Manufacturer: GENERIC; Manufacturer1 Part Number: 223878715649; Voltage: 16V; TC: X7R; Tolerance: ±10%; Table: Capacitors SMD; Part Number: CC0402_100NF_16V_10%_X7R; Component Kind: Standard; Component Type: Standard; Pin Count: 2; Value: 100nF; Status: Not Recommended; Manufacturer Part Number: CC0402_100NF_16V_10%_X7R; Case: 0402; Socket: No; SMD: Yes; Manufacturer1 Example: PHYCOMP; Manufacturer1 ComponentHeight: 0.55mm; HelpURL: \\cern.ch\dfs\Applications\Altium\Datasheets\CC0402_X7R_PHYCOMP.pdf; Author: CERN DEM JLC
  C2-C4 C7 C10 C15 C17 C19 C21-C23 C26 C27 C29 C34 C37 C41 C48 C51 C75 C80 C81 C88 C89 C236-C238: Mounted: Yes; CreateDate: 2007-12-03; LatestRevisionDate: 2007-12-03
  C36 C54 C74 C213: Mounted: Yes; CreateDate: 03/12/2007; LatestRevisionDate: 03/12/2007
  C40: CreateDate: 2007-12-03; LatestRevisionDate: 2007-12-03
  C386 C392 C407 C408: CreateDate: 03/12/2007; LatestRevisionDate: 03/12/2007
C6 C11 C12 C42 C50 = CC1206_22UF_10V_10%_X7R: Non-polarised capacitor; Part Description: SMD Multilayer Chip Ceramic Capacitor; Manufacturer: GENERIC; Manufacturer1 Part Number: GRM31CR71A226KE15L; Voltage: 10V; TC: X7R; Tolerance: ±10%; Table: Capacitors SMD; Part Number: CC1206_22UF_10V_10%_X7R; Component Kind: Standard; Component Type: Standard; Pin Count: 2; Value: 22uF; Status: Preferred; Manufacturer Part Number: CC1206_22UF_10V_10%_X7R; Case: 1206; Mounted: Yes; Socket: No; SMD: Yes; Manufacturer1 Example: MURATA; Manufacturer1 ComponentHeight: 1.8mm; HelpURL: \\cern.ch\dfs\Applications\Altium\Datasheets\CC1206_X7R_MURATA_GRM-HI-CAP.pdf; Author: CERN DEM JLC; CreateDate: 2010-06-08; LatestRevisionDate: 2010-06-08
C16 C200 C468 = CC0603_1UF_16V_10%_X7R: Non-polarised capacitor; Part Description: SMD Multilayer Chip Ceramic Capacitor; Manufacturer: GENERIC; Manufacturer1 Part Number: 223824613663; Voltage: 16V; TC: X7R; Tolerance: ±10%; Table: Capacitors SMD; Part Number: CC0603_1UF_16V_10%_X7R; Component Kind: Standard; Component Type: Standard; Pin Count: 2; Value: 1uF; Status: Preferred; Manufacturer Part Number: CC0603_1uF_16V_10%_X7R; Case: 0603; Mounted: Yes; Socket: No; SMD: Yes; Manufacturer1 Example: PHYCOMP; Manufacturer1 ComponentHeight: 0.87mm; HelpURL: \\cern.ch\dfs\Applications\Altium\Datasheets\CC0805_X5R_PHYCOMP_HC.pdf; Author: CERN DEM JLC; CreateDate: 03/12/2007; LatestRevisionDate: 03/12/2007
C52 C55 C453 = CC0603_1UF_16V_10%_X7R: Non-polarised capacitor; Part Description: SMD Multilayer Chip Ceramic Capacitor; Manufacturer: GENERIC; Manufacturer1 Part Number: 223824613663; Manufacturer1 Datasheet: \\cern.ch\dfs\Applications\Altium\Datasheets\CC0805_X5R_PHYCOMP_HC.pdf; Voltage: 16V; TC: X7R; Tolerance: ±10%; Table: Capacitors SMD; Part Number: CC0603_1UF_16V_10%_X7R; Component Kind: Standard; Component Type: Standard; Designator: Capacitor - non polarized; Library Reference: Capacitor - non polarized; Pin Count: 2; Value: 1uF; Status: Preferred; Manufacturer Part Number: CC0603_1uF_16V_10%_X7R; Case: 0603; Mounted: Yes; Socket: No; SMD: Yes; Manufacturer1 Example: PHYCOMP; Manufacturer1 ComponentHeight: 0.87mm; HelpURL: \\cern.ch\dfs\Applications\Altium\Datasheets\CC0805_X5R_PHYCOMP_HC.pdf; Author: CERN DEM JLC; CreateDate: 03/12/2007; LatestRevisionDate: 03/12/2007
IC1 = LP5951MF-3.0/NOPB: 150mA Micropower Low-Dropout CMOS Voltage Regulator; Part Description: 3V,  150mA Micropower Low-Dropout CMOS Voltage Regulator; Manufacturer: NATIONAL SEMICONDUCTOR; Table: Regulators; Part Number: LP5951MF-3.0/NOPB; Component Kind: Standard; Component Type: Standard; Device: LP5951MF-3.0/NOPB; PackageDescription: SOT23 5, Pitch 0.95mm - Body 1.67x2.99mm, IPC Medium Density; Manufacturer Part Number: LP5951MF-3.0/NOPB; Pin Count: 5; Case: SOT23-5; Mounted: Yes; Socket: No; SMD: Yes; ComponentHeight: 1.19mm; HelpURL: \\cern.ch\dfs\Applications\Altium\Datasheets\LP5951MF-3.0-NOPB.pdf; Author: CERN DEM JLC; CreateDate: 24/01/2011; LatestRevisionDate: 24/01/2011
IC3 IC7 = AD5662BRMZ-1: 2.7V to 5.5V, 250uA, Rail-to-Rail Output 16-Bit nanoDAC; Manufacturer: ANALOG DEVICES; Table: Analog & Interface; Part Number: AD5662BRMZ-1; Component Kind: Standard; Component Type: Standard; Device: AD5662BRMZ-1; PackageDescription: SOP, 8-Leads, Body 3.0x3.0mm, Pitch 0.65mm, IPC Medium Density; Part Description: 2.7V to 5.5V, 250uA, Rail-to-Rail Output 16-Bit nanoDAC; Manufacturer Part Number: AD5662BRMZ-1; Pin Count: 8; Case: MSOP8; Mounted: Yes; Socket: No; SMD: Yes; ComponentHeight: 1.1mm; Author: CERN DEM JLC; HelpURL: \\cern.ch\dfs\Applications\Altium\Datasheets\AD5662BRMZ-1.pdf; CreateDate: 1/10/2011; LatestRevisionDate: 1/10/2011
IC6 IC12 = CDCM61004RHBT: Four Output, Integrated VCO, Low-Jitter Clock Generator; Manufacturer: TEXAS INSTRUMENTS; Table: Analog & Interface; Part Number: CDCM61004RHBT; Component Kind: Standard; Component Type: Standard; Device: CDCM61004RHBT; PackageDescription: QFN, (MO-220-VHHD-4) 0.50mm pitch,square; 8 pin X 8 pin, 5mm X 5mm X 1.00mm H body (w/thermal tab 3.5 X 3.5mm),  IPC Medium Density; Part Description: Four Output, Integrated VCO, Low-Jitter Clock Generator; Manufacturer Part Number: CDCM61004RHBT; Pin Count: 33; Case: QFN32; Mounted: Yes; Socket: No; SMD: Yes; ComponentHeight: 1mm; Author: CERN DEM JLC; HelpURL: \\cern.ch\dfs\Applications\Altium\Datasheets\CDCM61004RHBT.pdf; CreateDate: 2010-08-25; LatestRevisionDate: 2010-08-25
IC10 = LM336M-2.5/NOPB: Reference Diode; Part Description: 2.5V Voltage Reference Diode; Manufacturer: NATIONAL SEMICONDUCTOR; Table: Regulators; Part Number: LM336M-2.5/NOPB; Component Kind: Standard; Component Type: Standard; Device: LM336M-2.5/NOPB; PackageDescription: SOIC 8, Pitch 1.27mm - Body 4x5mm, IPC Medium Density; Manufacturer Part Number: LM336M-2.5/NOPB; Pin Count: 3; Case: SOIC8; Mounted: Yes; Socket: No; SMD: Yes; ComponentHeight: 1.75mm; HelpURL: \\cern.ch\dfs\Applications\Altium\Datasheets\LM336M-2.5-NOPB.pdf; Author: CERN DEM JLC; CreateDate: 2010-04-12; LatestRevisionDate: 2010-04-12
IC11 = SN74LVC1GU04DCK: Single Inverter Buffer; Part Description: Single Inverter Gate; Manufacturer: TEXAS INSTRUMENTS; Table: Standard Logic; Part Number: SN74LVC1GU04DCK; Component Kind: Standard; Component Type: Standard; Device: SN74LVC1GU04DCK; PackageDescription: SOT353, SC70-5, SOT, 0.65mm Pitch, 5 pin, 1.25mm W X 2.00mm L X 1.10mm H, IPC Medium Density; Manufacturer Part Number: SN74LVC1GU04DCK; Pin Count: 2; Case: SOT353; Mounted: Yes; Socket: No; SMD: Yes; ComponentHeight: 1.1mm; Author: CERN DEM JLC; HelpURL: \\cern.ch\dfs\Applications\Altium\Datasheets\SN74LVC1GU04DCK.pdf; CreateDate: 2011-02-16; LatestRevisionDate: 2011-02-16
J12-J15 = HIROSE_U.FL-R-SMT-1(10): Part Description: Up to 6GHz Ultra Small Surface Mount Male Coaxial Connectors U.FL Series; Manufacturer: HIROSE (HRS); Table: Miscellaneous; Part Number: HIROSE_U.FL-R-SMT-1(10); Component Kind: Standard; Component Type: Standard; Pin Count: 2; Family: U.FL; Socket: No; SMD: Yes; Status: None; Manufacturer Part Number: U.FL-R-SMT-1(10); ComponentHeight: 1.25mm; HelpURL: \\cern.ch\dfs\Applications\Altium\Datasheets\HIROSE_U.FL-R-SMT-1(10).pdf; Author: CERN DEM JLC; CreateDate: 2010-03-24; LatestRevisionDate: 2010-03-24
L1 L2 L6 L21 = IND0805_MURATA_BLM21PG221SN1D: Inductor; Part Description: SMD EMIFIL Suppression Chip Bead Ferrite; Manufacturer: MURATA; Power: 2A; Resistance: 0.05R; Tolerance: ±25%; Table: Inductors SMD; Part Number: IND0805_MURATA_BLM21PG221SN1D; Component Kind: Standard; Component Type: Standard; Pin Count: 2; Value: 220R@100MHz; Status: None; Manufacturer Part Number: BLM21PG221SN1D; Case: 0805; Mounted: Yes; Socket: No; SMD: Yes; ComponentHeight: 1.05mm; HelpURL: \\cern.ch\dfs\Applications\Altium\Datasheets\IND0402_MURATA_BLM21P.pdf; Author: CERN DEM JLC; CreateDate: 25/01/2010; LatestRevisionDate: 25/01/2010
OSC1 = OSC_25MHZ_RAKON_IVT3205CR: Oscillator 4 pins 1=VCO 3=GND 4=OUT 6=VDC; Part Description: 11pF 3.3V ±1ppm Surface Mount TCXO Voltage Controlled Oscillator (IT3200C Serie); Manufacturer: RAKON; Table: Crystals & Oscillators; Part Number: OSC_25MHZ_RAKON_IVT3205CR; Component Kind: Standard; Component Type: Standard; PackageDescription: Oscillator IVT3200C Serie, corner concave; 4 pin, 2.50mm L X 3.2mm W X 1.1mm H; Value: 25MHz; Pin Count: 4; Socket: No; SMD: Yes; ComponentHeight: 1.1mm; HelpURL: \\cern.ch\dfs\Applications\Altium\Datasheets\OSC_RAKON_IVT3200C.pdf; Author: CERN DEM JLC; CreateDate: 08/02/2010; LatestRevisionDate: 08/02/2010
OSC2 = OSC_20MHZ_IQD_LF VCXO026156: 3.3V ±100ppm 15pF HCMOS Tri-State Surface Mount Voltage Controlled Oscillator VCXO (CFPV-45 Serie); Manufacturer: IQD FREQUENCY PRODUCTS; Table: Crystals & Oscillators; Part Number: OSC_20MHZ_IQD_LF VCXO026156; Component Kind: Standard; Component Type: Standard; PackageDescription: SMD VCXO, side convave, 6 pins, 5.00x7.00mm (CFPV-45 Serie); Value: 20MHz; Part Description: 3.3V ±100ppm 15pF HCMOS Tri-State Surface Mount Voltage Controlled Oscillator VCXO (CFPV-45 Serie); Pin Count: 6; Mounted: Yes; Socket: No; SMD: Yes; ComponentHeight: 1.7mm; HelpURL: \\cern.ch\dfs\Applications\Altium\Datasheets\OSC_IQD_CFPV-45.pdf; Author: CERN DEM JLC; CreateDate: 1/24/2011; LatestRevisionDate: 1/24/2011
OSC3 = OSC_10-280MHZ_SILICON-LAB_Si570BBC000121DG: Any-Rate I2C Programmable XO Oscillator Si570 Serie; Part Description: 10-280MHz 3.3V ±20ppm LVDS Any-Rate I2C Programmable XO Oscillator Si570 Serie; Manufacturer: SILICON LABS; Table: Crystals & Oscillators; Part Number: OSC_10-280MHZ_SILICON-LAB_Si570BBC000121DG; Component Kind: Standard; Component Type: Standard; PackageDescription: Oscillator Si570 Serie, 8 pins, 5x7mm; Value: 10-280MHz; Pin Count: 8; Mounted: Yes; Socket: No; SMD: Yes; ComponentHeight: 1.85mm; HelpURL: \\cern.ch\dfs\Applications\Altium\Datasheets\OSC_SILICON-LAB_SI570.pdf; Author: CERN DEM JLC; CreateDate: 2010-02-09; LatestRevisionDate: 2010-02-09
OSC5 = OSC_25MHZ_MERCURY_VM53S3-25.000-2.5/-30+75: Oscillator 4 pins 1=VC 2=GND 3=OUT 4=+Vs; Part Description: 3V ±2.5ppmVoltage Controlled Temperature Compensated Crystal Oscillator VM53S3 Serie; Manufacturer: MERCURY ELECTRONICS; Table: Crystals & Oscillators; Part Number: OSC_25MHZ_MERCURY_VM53S3-25.000-2.5/-30+75; Component Kind: Standard; Component Type: Standard; PackageDescription: SMD Oscillator, Corner Convave, 4 pins, 5x3.2mm; Value: 25MHz; Pin Count: 4; Socket: No; SMD: Yes; ComponentHeight: 1.6mm; HelpURL: \\cern.ch\dfs\Applications\Altium\Datasheets\OSC_MERCURY_VM53S3.pdf; Author: CERN DEM JLC; CreateDate: 1/20/2010; LatestRevisionDate: 1/24/2011
R1 R4-R6 R8 R10 R23-R25 R245 R249-R254 = R0603_0R_JUMPER: as R132 on sheet SFPGA; Part Number: R0603_0R_JUMPER; Component Kind: Standard; Component Type: Standard; Pin Count: 2; Value: 0; Status: Preferred; Manufacturer Part Number: R0603_0R_JUMPER; Socket: No; SMD: Yes; Manufacturer1 Example: NIC COMPONENT; Manufacturer1 ComponentHeight: 0.55mm; HelpURL: \\cern.ch\dfs\Applications\Altium\Datasheets\R0603_NIC_NRC.pdf; Author: CERN DEM JLC; CreateDate: 2007-12-03; LatestRevisionDate: 2008-03-13
  R1 R4 R6 R8 R10 R23-R25 R249-R254: Case: 0603
R9 R15 R36 R122 R135 R138 R140 = R0603_240R_1%_0.1W_100PPM: Resistor - 1%; Part Description: General Purpose Thick Film Chip Resistor; Manufacturer: GENERIC; Manufacturer1 Part Number: NRC06F2400TRF; Power: 0.1W; TC: ±100ppm/°C; Table: Resistors SMD; Part Number: R0603_240R_1%_0.1W_100PPM; Component Kind: Standard; Component Type: Standard; Pin Count: 2; Value: 240; Status: Preferred; Tolerance: ±1%; Manufacturer Part Number: R0603_240R_1%_0.1W_100PPM; Case: 0603; Mounted: Yes; Socket: No; SMD: Yes; Manufacturer1 Example: NIC COMPONENT; Manufacturer1 ComponentHeight: 0.55mm; HelpURL: \\cern.ch\dfs\Applications\Altium\Datasheets\R0603_NIC_NRC.pdf; Author: CERN DEM JLC; CreateDate: 12/3/2007; LatestRevisionDate: 3/13/2008
R16 = R0603_100R_1%_0.1W_100PPM: Resistor - 1%; Part Description: General Purpose Thick Film Chip Resistor; Manufacturer: GENERIC; Manufacturer1 Part Number: NRC06F4700TRF; Power: 0.1W; TC: ±100ppm/°C; Table: Resistors SMD; Part Number: R0603_100R_1%_0.1W_100PPM; Component Kind: Standard; Component Type: Standard; Pin Count: 2; Value: 100; Status: Preferred; Tolerance: ±1%; Manufacturer Part Number: R0603_100R_1%_0.1W_100PPM; Case: 0603; Socket: No; SMD: Yes; Manufacturer1 Example: NIC COMPONENT; Manufacturer1 ComponentHeight: 0.55mm; HelpURL: \\cern.ch\dfs\Applications\Altium\Datasheets\R0603_NIC_NRC.pdf; Author: CERN DEM JLC; CreateDate: 2007-12-03; LatestRevisionDate: 2008-03-13
R18-R20 = R0603_5K1_1%_0.1W_100PPM: as R131 on sheet SFPGA; Part Number: R0603_5K1_1%_0.1W_100PPM; Component Kind: Standard; Component Type: Standard; Pin Count: 2; Value: 5k1; Status: Preferred; Tolerance: ±1%; Manufacturer Part Number: R0603_5K1_1%_0.1W_100PPM; Case: 0603; Mounted: Yes; Socket: No; SMD: Yes; Manufacturer1 Example: NIC COMPONENT; Manufacturer1 ComponentHeight: 0.55mm; HelpURL: \\cern.ch\dfs\Applications\Altium\Datasheets\R0603_NIC_NRC.pdf; Author: CERN DEM JLC; CreateDate: 03/12/2007; LatestRevisionDate: 13/03/2008
R27 R152 = R0603_39R_1%_0.1W_100PPM: Resistor - 1%; Part Description: General Purpose Thick Film Chip Resistor; Manufacturer: GENERIC; Manufacturer1 Part Number: NRC06F39R0TRF; Power: 0.1W; TC: ±100ppm/°C; Table: Resistors SMD; Part Number: R0603_39R_1%_0.1W_100PPM; Component Kind: Standard; Component Type: Standard; Pin Count: 2; Value: 39; Status: Preferred; Tolerance: ±1%; Manufacturer Part Number: R0603_39R_1%_0.1W_100PPM; Case: 0603; Mounted: Yes; Socket: No; SMD: Yes; Manufacturer1 Example: NIC COMPONENT; Manufacturer1 ComponentHeight: 0.55mm; HelpURL: \\cern.ch\dfs\Applications\Altium\Datasheets\R0603_NIC_NRC.pdf; Author: CERN DEM JLC; CreateDate: 2007-12-03; LatestRevisionDate: 2008-03-13